# Altium schematic sheet P1.schdoc
size 297 x 209 mm; Symbol: Drawing-Symbol_A4; @Project Name: Weather-Station; @Page Count: 1; @Update Date: 2026-03-24; @Create Date: 2025-12-29; @Schematic Name: Pressure Temp Humid; @Page No: 1; @Page Name: P1; Company: EasyEDA.com; Version: V1.0; Page Size: A4; @Create Time: 10:42:07; @Update Time: 15:28:37; Border: 1; Width: 1170; Height: 825; Region Start: 1; X Region Count: 6; Y Region Count: 4; Blade Width: 10; Title Block Position: 3; @Board Name: I2C-Sensors; Device: Drawing-Symbol_A4
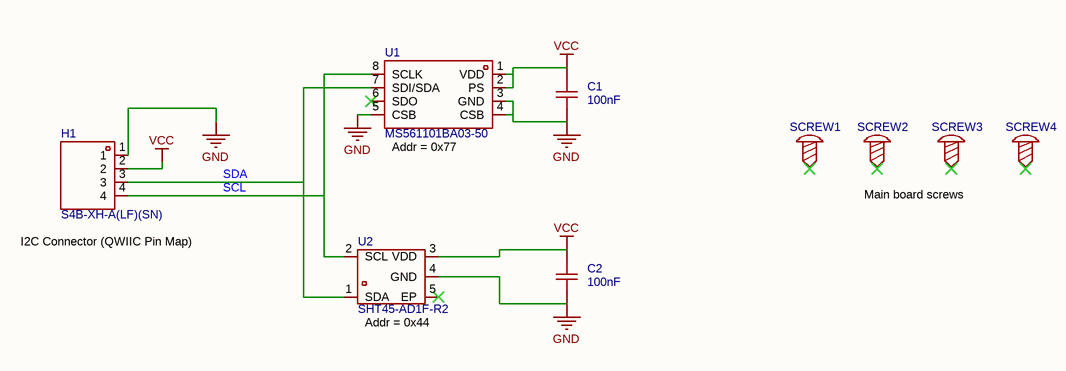
[diagram p0: P1.schdoc]

## Parts
C1  100nF  [C0402]
C2  100nF  [C0402]
H1  S4B-XH-A(LF)(SN)  [CONN-TH_S4B-XH-A-LF-SN]
SCREW1  (no value)  [Screw-Hole-M3]
SCREW2  (no value)  [Screw-Hole-M3]
SCREW3  (no value)  [Screw-Hole-M3]
SCREW4  (no value)  [Screw-Hole-M3]
U1  MS561101BA03-50  [SENSORS-SMD_MS5611-01BA03]
U2  SHT45-AD1F-R2  [DFN-4_L1.5-W1.5-P0.8-TL-EP]

## Nets
GND: C1.2 C2.2 H1.1 U1.3(GND) U1.4(CSB) U1.5(CSB) U2.4(GND)
VCC: C1.1 C2.1 H1.2 U1.1(VDD) U1.2(PS) U2.3(VDD)
SCL: H1.4 U1.8(SCLK) U2.2(SCL)
SDA: H1.3 U1.7(SDI/SDA) U2.1(SDA)

Not connected (* = marked no-connect by the designer): SCREW1 1*; SCREW2 1*; SCREW3 1*; SCREW4 1*; U1 6(SDO)*; U2 5(EP)*

## Notes on the sheet
- (near U1) Addr = 0x77
- Main board screws
- (near H1) I2C Connector (QWIIC Pin Map)
- (near U2) Addr = 0x44
- Create at
- 2025-12-29
- Schematic
- Board
- Pressure Temp Humid
- I2C-Sensors
- Update at
- Page
- 2026-03-24
- P1
- Drawn
- Reviewed
- Weather-Station
- Version
- V1.0
- Size
- A4
- Page  1  Total  1
- EasyEDA.com

## Library data of the parts
C1 C2 = CL05B104KO5NNNC: Capacitance:100nF Tolerance:±10% Tolerance:±10% Voltage Rating:16V Temperature Coefficient:X7R; Manufacturer: SAMSUNG(三星); Symbol: CAP; AddInBom: yes; ModelId: b7d13df3e9464d7a99d0651d1a5b4d57; ModelName: C0402_L1.0-W0.5-H0.5; ModelTransform: 39.37,19.685,0,0,0,0,0,0,0; Tolerance: ±10%; Voltage Rating: 16V; Temperature Coefficient: X7R; Device: CL05B104KO5NNNC; LCSC Part Name: 100nF ±10% 16V; ManufacturerPart: CL05B104KO5NNNC; Supplier Footprint: 0402; JLCPCB Part Class: Basic Part; Datasheet: https://item.szlcsc.com/datasheet/CL05B104KO5NNNC/1877.html; Supplier: LCSC; ConvertToPcb: yes; FootprintName: C0402; Value: 100nF
  C1: SupplierPart: C1525
  C2: Supplier Part: C1525
H1 = S4B-XH-A(LF)(SN): Pins Structure:1x4P Pitch:2.5mm Mounting Type:Right Angle Reference Series:XH Number of Pins:4P Number of Rows:1 Number of PINs Per Row:4 Row Spacing:- Current Rating:3A Contact Material:Brass Contact Plating:Tin Operating Temperature:-25℃~+85℃ Operating; Manufacturer: JST; AddInBom: yes; ModelId: 77a2ced4cba941c49e3f4130b9ad2f4f; ModelTransform: 488.19194,452.755,0,180,0,0,0.591,136.378,-133.858; Pins Structure: 1x4P; Pitch: 2.5mm; Reference Series: XH; Number of PINs Per Row: 4; Current Rating: 3A; Voltage Rating: 250V; Plastic Material: PA66; Flame Retardant Rating: UL94V-0; Supplementary Features: K Pin; Z-Height of the Board: 6.1mm; X-Length of Bottom Edge on Board (Spacing Line): 12.4mm; Y-Width of Bottom Edge on Board: 11.5mm; Symbol: S4B-XH-A (LF)(SN); Device: S4B-XH-A(LF)(SN); LCSC Part Name: 1x4P 间距:2.5mm 弯插 系列:XH; SupplierPart: C157925; ManufacturerPart: S4B-XH-A(LF)(SN); Supplier Footprint: 弯插,P=2.5mm; JLCPCB Part Class: Extended Part; Datasheet: https://item.szlcsc.com/datasheet/S4B-XH-A(LF)(SN)/169273.html; Supplier: LCSC; ConvertToPcb: yes; FootprintName: CONN-TH_S4B-XH-A-LF-SN; ModelName: CONN-TH_S4B-XH-A-LF-SN; Mounting Type: Right Angle; Number of Pins: 4P; Number of Rows: 1; Row Spacing: -; Contact Material: Brass; Contact Plating: Tin; Operating Temperature: -25℃~+85℃; Color: White
SCREW1-SCREW4 = Screw-Hole-M3: Add into BOM: no; ConvertToPcb: yes; Device: Screw-Hole-M3; Supplier Footprint: 插件; SymbolName: Screw-Hole; FootprintName: Screw-Hole-M3
U1 = MS561101BA03-50: Pressure range:1Kpa~1.2bar Pressure range:1Kpa~1.2bar Voltage - Supply:1.8V~3.6V Voltage - Supply:1.8V~3.6V Standby Current:140nA Interface:SPI；I2C Operating Temperature:-40℃~+85℃ Operating Temperature:-40℃~+85℃ Module:Yes Absolute Accuracy:150pa Response; Manufacturer: TE Connectivity(泰科电子); AddInBom: yes; ModelId: 672fc546baaf493a9f668044721589aa; ModelTransform: 196.85,118.11,0,0,0,0,0,0,0; Standby Current: 140nA; Absolute Accuracy: 150pa; Response time: 8.22ms; Symbol: MS561101BA03-50; Device: MS561101BA03-50; LCSC Part Name: MS561101BA03-50; SupplierPart: C15639; ManufacturerPart: MS561101BA03-50; Supplier Footprint: QFN-8(3x5); JLCPCB Part Class: Extended Part; Datasheet: https://item.szlcsc.com/datasheet/MS561101BA03-50/16320.html; Supplier: LCSC; ConvertToPcb: yes; FootprintName: SENSORS-SMD_MS5611-01BA03; ModelName: SENSORS-SMD_MS5611-01BA03; Pressure range: 1Kpa~1.2bar; Voltage - Supply: 1.8V~3.6V; Interface: SPI；I2C; Operating Temperature: -40℃~+85℃; Module: Yes
U2 = SHT45-AD1F-R2: Temperature Range:-40℃~+125℃ Temperature Range:-40℃~+125℃ Humidity:0%RH~100%RH Humidity:0%RH~100%RH Interface:I2C Voltage - Supply:1.08V~3.6V Voltage - Supply:1.08V~3.6V Current - Supply:400nA Humidity Tolerance:±1%RH Humidity Tolerance:±1%RH Temperature; Manufacturer: Sensirion(瑞士盛思锐); AddInBom: yes; ModelId: 6f8b3ae961c04cddbf954b0fead8976b; ModelName: DFN-4_L1.5-W1.5-P0.8; ModelTransform: 59.8424,59.8424,0,0,0,0,0,0,0; Interface: I2C; Current - Supply: 400nA; Humidity Tolerance: ±1%RH; Temperature Tolerance: ±0.1℃; Resolution: 16bit; Symbol: SHT45-AD1F-R2; Device: SHT45-AD1F-R2; LCSC Part Name: 3.000.886 第四代高精度、超低功耗16位相对湿度和温度传感器; SupplierPart: C5360602; ManufacturerPart: SHT45-AD1F-R2; Supplier Footprint: DFN-4; JLCPCB Part Class: Extended Part; Datasheet: https://item.szlcsc.com/datasheet/SHT45-AD1F-R2/6178791.html; Supplier: LCSC; ConvertToPcb: yes; FootprintName: DFN-4_L1.5-W1.5-P0.8-TL-EP; Temperature Range: -40℃~+125℃; Humidity: 0%RH~100%RH; Voltage - Supply: 1.08V~3.6V